# Altium project ECU V1.0 B.PrjPcb (part 2 of 17)
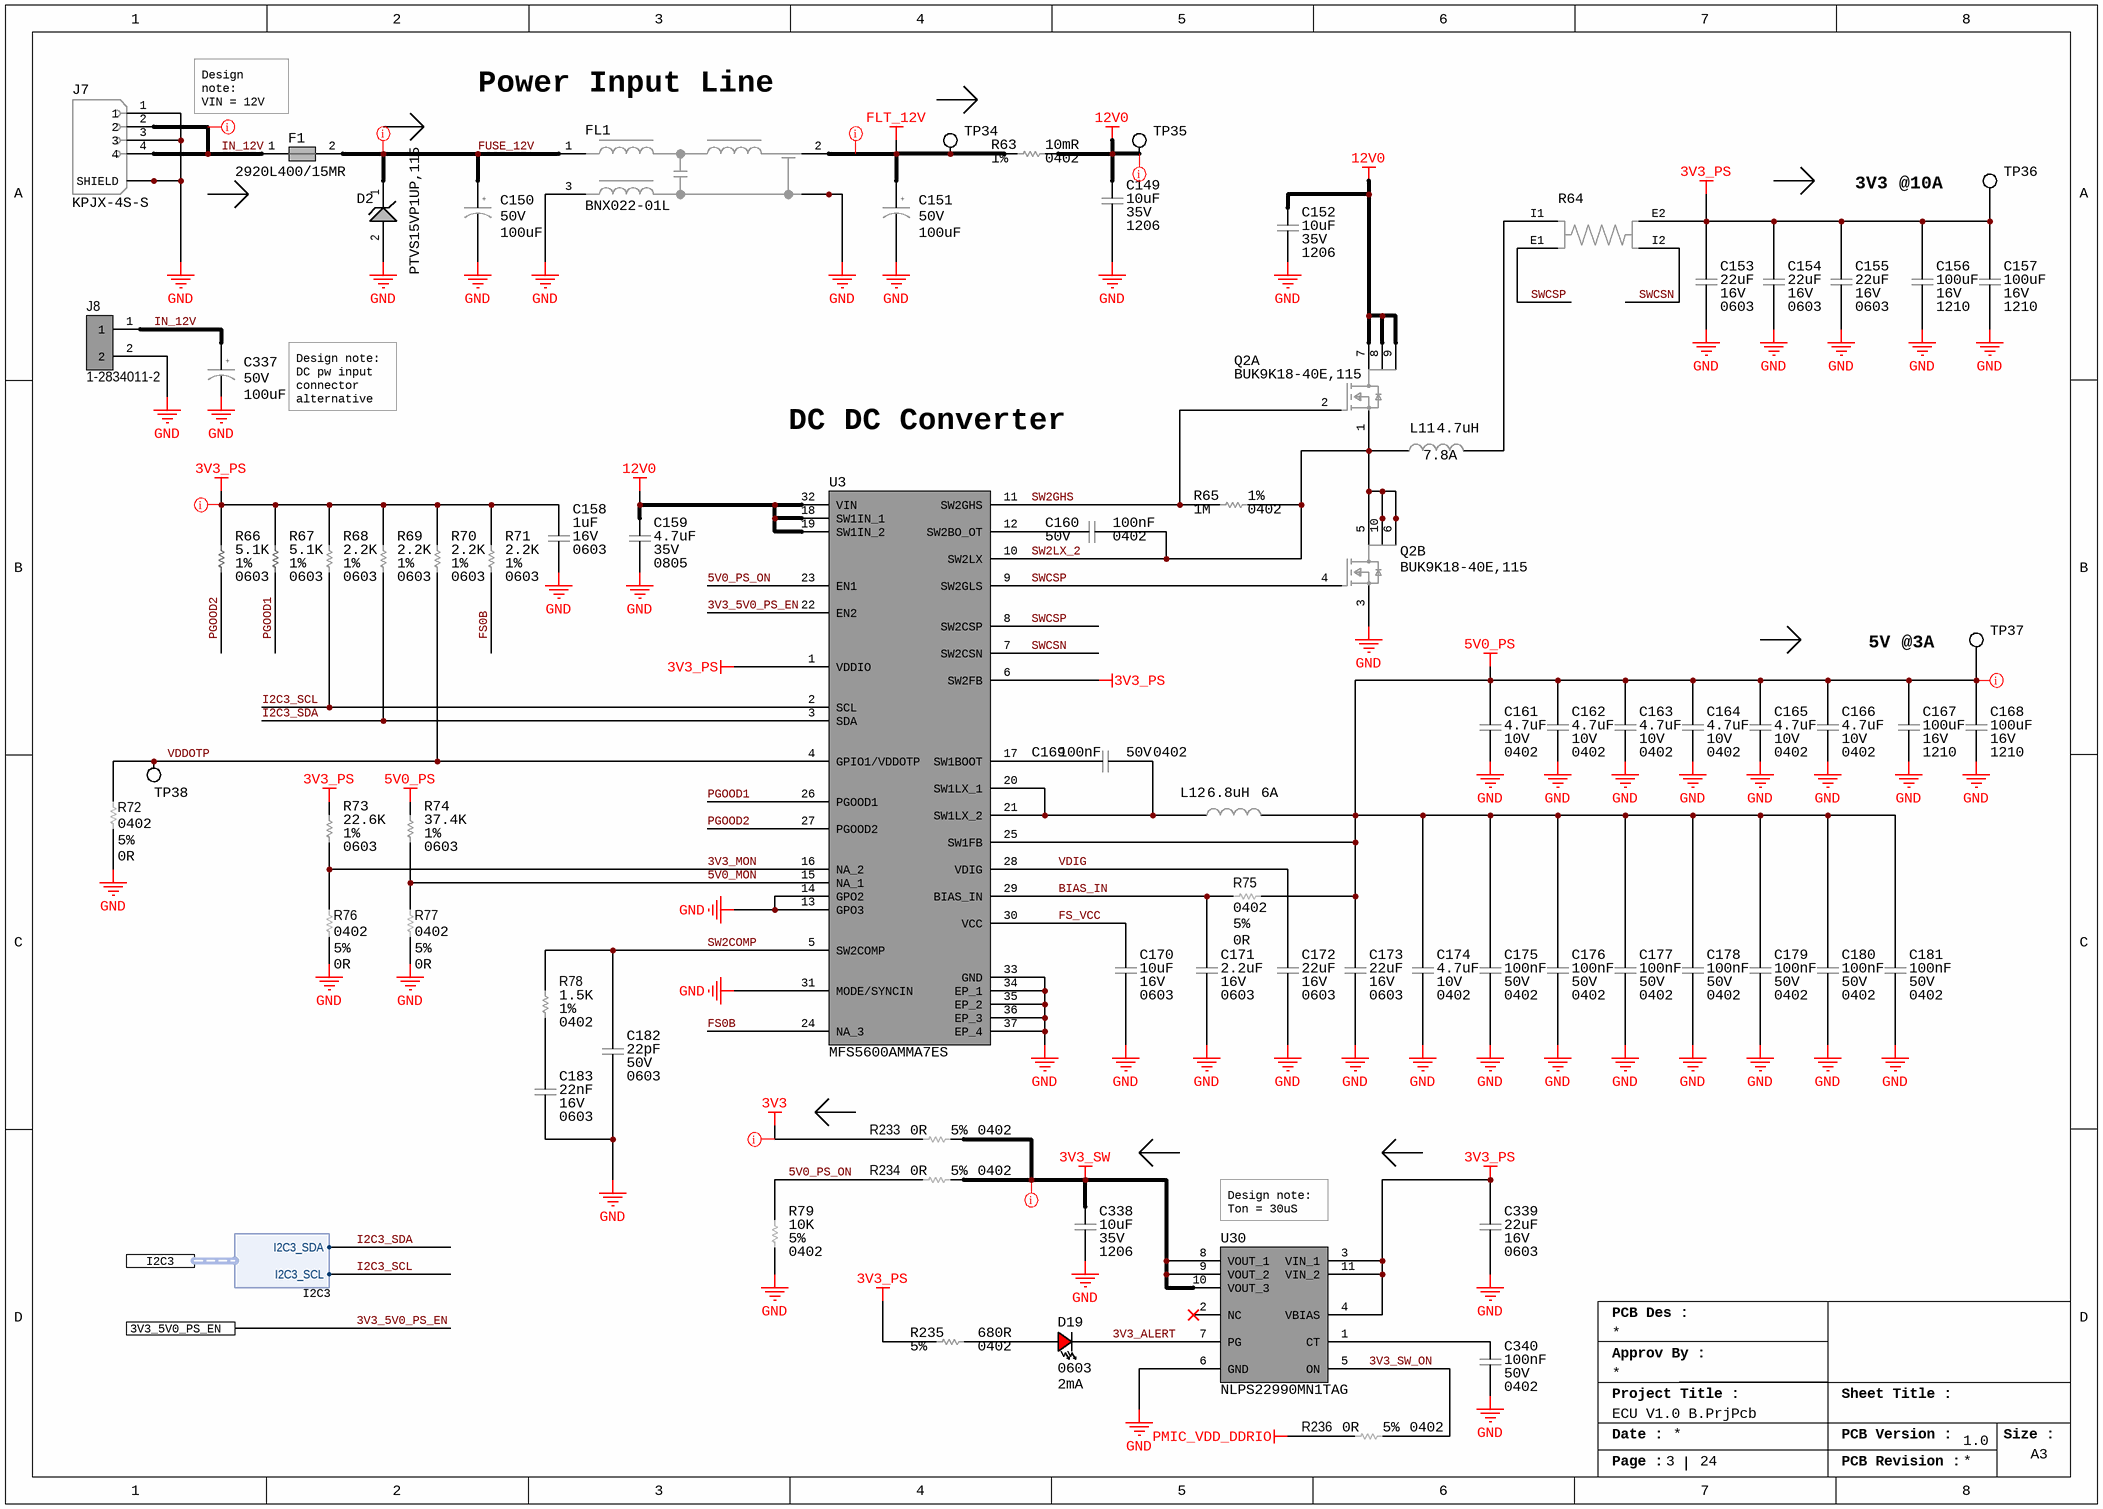
[diagram p18: 02_PWR IN.SchDoc]

## Sheet 02_PWR IN.SchDoc (continued)
### Library data of the parts
C149 C152 C338 = CAP_10uF_35V_X5R_1206: 1206 10 uF 35 V ±10 % Tolerance X5R SMT Multilayer Ceramic Capacitor; Manufacturer: Murata; Tolerance: 10%; Supplier 1: Mouser; Manufacturer Part Number: GRM319R6YA106KA12D; RoHS: Yes; Category: Ceramic Capacitors; Stock 1: 129741; Pricing 1: 1=0.3, 10=0.169, 50=0.169, 100=0.109, 1000=0.082, 10000=0.066 (USD); Mount: Surface Mount; Case Code (Metric): 3216; Case Code (Imperial): 1206; Weight: 0.001411oz; Min Operating Temperature: -55°C; Max Operating Temperature: 85°C; Packaging: Tape and Reel; Dielectric: X5R; Termination: Standard; Voltage Rating (DC): 35V; Package Quantity: 40000; Series: GRM; Length: 3.2mm; Width: 1.6mm; Height: 0.85mm; RoHS Compliant: Yes; ComponentLink1URL: http://www.farnell.com/datasheets/2079193.pdf?src-supplier=Farnell; ComponentLink1Description: http://www.farnell.com/datasheets/2079193.pdf?src-supplier=Farnell; ComponentLink2URL: http://www.mouser.com/ds/2/281/c02e-2905.pdf?src-supplier=Mouser; ComponentLink2Description: http://www.mouser.com/ds/2/281/c02e-2905.pdf?src-supplier=Mouser; ComponentLink3URL: http://search.murata.co.jp/Ceramy/image/img/A01X/G101/ENG/GRM319R6YA106KA12-01.pdf?src-supplier=Digi-Key; ComponentLink3Description: http://search.murata.co.jp/Ceramy/image/img/A01X/G101/ENG/GRM319R6YA106KA12-01.pdf?src-supplier=Digi-Key; ComponentLink4URL: http://www.farnell.com/datasheets/2079193.pdf?src-supplier=Element14; ComponentLink4Description: http://www.farnell.com/datasheets/2079193.pdf?src-supplier=Element14; ComponentLink5URL: https://datasheet.octopart.com/GRM319R6YA106KA12D-Murata-datasheet-136617269.pdf?src-supplier=TME; ComponentLink5Description: https://datasheet.octopart.com/GRM319R6YA106KA12D-Murata-datasheet-136617269.pdf?src-supplier=TME; Supplier Part Number 1: 81-GRM319R6YA106KA2D
C150 C151 C337 = CAP_100UF_50V_POL: Radial Can - SMD ALUMINUM ELECTROLYTIC CAPACITOR UUD 50V 100muF ±20% 0.315Dia 8.00mm; Manufacturer: Nichicon; Dielectric Material: Aluminium; Ripple Current (AC): 300mA; Impedance: 340mR; Leakage Current: 3uA; Life (Hours): 5000Hour; Dissipation Factor: 0.14%; Polarity: 5066Direction; Lead Diameter: 1.1mm; Supplier 1: Mouser; Manufacturer Part Number: UUD1H101MNL1GS; RoHS: Yes; Category: Aluminum Electrolytic Capacitors; Stock 1: 2204; Pricing 1: 1=0.53, 10=0.313, 50=0.313, 100=0.202, 500=0.202, 1000=0.171, 2500=0.151, 10000=0.138, 25000=0.136, 50000=0.131 (USD); Case/Package: Radial; Number of Pins: 2; Min Operating Temperature: -55°C; Max Operating Temperature: 105°C; Tolerance: 20%; Package Quantity: 500; Ripple Current: 300mA; Packaging: Tape and Reel; Voltage Rating: 50V; Termination: SMD/SMT; Voltage: 50V; Series: UD; Construction: Cylindrical; Voltage Rating (AC): 50V; Diameter: 8mm; Length: 10mm; Height: 10mm; Lead Pitch: 3.1mm; Height - Seated (Max): 0.394inch; Radiation Hardening: No; Reach SVHC Compliant: No; Lead Free: Lead Free; RoHS Compliant: Yes; ComponentLink1URL: https://datasheet.ciiva.com/11781/0900766b80fa39e7-11781901.pdf?src-supplier=Rs; ComponentLink1Description: https://datasheet.ciiva.com/11781/0900766b80fa39e7-11781901.pdf?src-supplier=Rs; ComponentLink2URL: https://datasheet.ciiva.com/28458/e-ud-28458117.pdf?src-supplier=Element14; ComponentLink2Description: https://datasheet.ciiva.com/28458/e-ud-28458117.pdf?src-supplier=Element14; ComponentLink3URL: https://datasheet.ciiva.com/28458/1910936-28458133.pdf?src-supplier=Element14; ComponentLink3Description: https://datasheet.ciiva.com/28458/1910936-28458133.pdf?src-supplier=Element14; ComponentLink4URL: https://datasheet.ciiva.com/7781/66055-7781450.pdf?src-supplier=Element14; ComponentLink4Description: https://datasheet.ciiva.com/7781/66055-7781450.pdf?src-supplier=Element14; ComponentLink5URL: https://datasheet.ciiva.com/5362/e-ud-5362134.pdf?src-supplier=Mouser; ComponentLink5Description: https://datasheet.ciiva.com/5362/e-ud-5362134.pdf?src-supplier=Mouser; Supplier Part Number 1: 647-UUD1H101MNL
C153-C155 C172 C173 C339 = CAP_22UF_16V_X5R_0603: Cap Ceramic 22uF 16V X5R 20% Pad SMD 0603 85C T/R; Manufacturer: Samsung; Supplier 1: Digi-Key; Manufacturer Part Number: CL10A226MO7JZNC; RoHS: Yes; Category: Ceramic Capacitors; Stock 1: 1760065; Pricing 1: 1=0.59, 10=0.419, 50=0.3164, 100=0.2756, 500=0.20418, 1000=0.17355 (USD); Mount: Surface Mount; Case Code (Imperial): 0603; Case Code (Metric): 1608; Min Operating Temperature: -55°C; Max Operating Temperature: 85°C; Packaging: Cut Tape; Tolerance: 20%; Series: CL; RoHS Compliant: Yes; ComponentLink1URL: http://www.samsungsem.com/kr/support/product-search/mlcc/CL10A226MO7JZNC.jsp?src-supplier=Digi-Key; ComponentLink1Description: http://www.samsungsem.com/kr/support/product-search/mlcc/CL10A226MO7JZNC.jsp?src-supplier=Digi-Key; ComponentLink2URL: https://datasheet.octopart.com/CL10A226MO7JZNC-Samsung-Electro-Mechanics-datasheet-149156497.pdf?src-supplier=Future+Electronics; ComponentLink2Description: https://datasheet.octopart.com/CL10A226MO7JZNC-Samsung-Electro-Mechanics-datasheet-149156497.pdf?src-supplier=Future+Electronics; Supplier Part Number 1: 1276-7076-1-ND
C156 C157 C167 C168 = CAP_100UF_16V_X5R_1210: Multilayer Ceramic Capacitor, 100 uF, 16 V, ± 20%, X5R, 1210 [3225 Metric]; Manufacturer: Taiyo Yuden; Material: 4241ConductorMaterial; Supplier 1: Digikey; Manufacturer Part Number: EMK325ABJ107MM-T; RoHS: Yes; Category: Ceramic Capacitors; Stock 1: 503358; Pricing 1: 1=1.73, 10=1.295, 50=1.1816, 100=0.9681 (USD); Mount: Surface Mount; Case Code (Metric): 3225; Case Code (Imperial): 1210; Min Operating Temperature: -55°C; Max Operating Temperature: 85°C; Tolerance: 20%; Packaging: Tape and Reel; Package Quantity: 500; Voltage Rating (DC): 16V; Dielectric: X5R; Termination: SMD/SMT; Series: M; Length: 3.2mm; Width: 2.5mm; Height: 2.5mm; Reach SVHC Compliant: No; RoHS Compliant: Yes; ComponentLink1URL: http://www.farnell.com/datasheets/1497285.pdf?src-supplier=Farnell; ComponentLink1Description: http://www.farnell.com/datasheets/1497285.pdf?src-supplier=Farnell; Supplier Part Number 1: 587-3152-1-ND
C158 = CAP_1UF_16V_X5R_0603: CAP CER 1UF 16V X5R 0603; Manufacturer: Samsung; Material: Ceramic; Tolerance: 10%; Manufacturer Part Number: CL10A105KO8NNNC; RoHS: Yes; Category: Ceramic Capacitors; Stock 1: 252255; Pricing 1: 1=0.10000, 10=0.03300, 50=0.01800, 100=0.01470, 500=0.01050, 1000=0.00825 (USD); Mount: Surface Mount; Case Code (Metric): 1608; Case Code (Imperial): 0603; Contact Plating: Tin; Min Operating Temperature: -55°C; Max Operating Temperature: 85°C; Package Quantity: 1; Packaging: Tape and Reel; Dielectric: X5R; Voltage Rating (DC): 16V; Series: CL; Voltage: 16V; Construction: Flat; Length: 1.6mm; Width: 0.031inch; Height: 0.8mm; Thickness: 0.035inch; Depth: 0.8mm; Radiation Hardening: No; Lead Free: Lead Free; RoHS Compliant: Yes; ComponentLink1URL: https://datasheet.ciiva.com/16199/cl10a105ko8nnnc-16199033.pdf?src-supplier=Future+Electronics; ComponentLink1Description: https://datasheet.ciiva.com/16199/cl10a105ko8nnnc-16199033.pdf?src-supplier=Future+Electronics; ComponentLink2URL: https://datasheet.ciiva.com/15195/getdatasheetpartid-359688-15195706.pdf?src-supplier=Verical; ComponentLink2Description: https://datasheet.ciiva.com/15195/getdatasheetpartid-359688-15195706.pdf?src-supplier=Verical; ComponentLink3URL: https://datasheet.ciiva.com/29198/458190-da-01-en-vs-kondensator-0603-29198480.pdf?src-supplier=Conrad; ComponentLink3Description: https://datasheet.ciiva.com/29198/458190-da-01-en-vs-kondensator-0603-29198480.pdf?src-supplier=Conrad; Supplier 1: Digi-Key; Supplier 2: Mouser; Supplier 3: Newark; Supplier Part Number 1: 1276-1034-1-ND; Supplier Part Number 2: 187-CL10A105KO8NNNC; Supplier Part Number 3: 82AC9279
C159 = CAP_4.7uF_35V_X5R_0805: CL Series 0805 35 V 4.7 uF ±10% Tolerance X5R Multilayer Ceramic Chip Capacitor; Manufacturer: Samsung; Supplier 1: Digikey; Manufacturer Part Number: CL21A475KLCLQNC; RoHS: Yes; Category: Ceramic Capacitors; Stock 1: 96096; Pricing 1: 1=0.16, 10=0.093, 100=0.0574, 1000=0.03903 (USD); Mount: Surface Mount; Case Code (Metric): 2012; Case Code (Imperial): 0805; Material: Ceramic; Min Operating Temperature: -55°C; Max Operating Temperature: 85°C; Packaging: Cut Tape; Tolerance: 10%; Series: CL; Height: 1.45mm; RoHS Compliant: Yes; ComponentLink1URL: http://www.samsungsem.com/kr/support/product-search/mlcc/CL21A475KLCLQNC.jsp?src-supplier=Digikey; ComponentLink1Description: http://www.samsungsem.com/kr/support/product-search/mlcc/CL21A475KLCLQNC.jsp?src-supplier=Digikey; ComponentLink2URL: https://datasheet.octopart.com/CL21A475KLCLQNC-Samsung-Electro-Mechanics-datasheet-136031818.pdf?src-supplier=Future+Electronics; ComponentLink2Description: https://datasheet.octopart.com/CL21A475KLCLQNC-Samsung-Electro-Mechanics-datasheet-136031818.pdf?src-supplier=Future+Electronics; Supplier Part Number 1: 1276-6722-1-ND
C160 C169 C175-C181 C340 = CAP_100NF_50V_X7R_0402: Multilayer Ceramic Capacitor, 0.1 uF, 16 V, ± 10%, X7R, 0402 [1005 Metric]; Manufacturer: Murata; Dissipation Factor: 0.025%; Temperature Coefficient: 30ppm/°C; Supplier 1: DigiKey; Manufacturer Part Number: GRM155R71H104KE14D; RoHS: Yes; Category: Ceramic Capacitors; Stock 1: 13730790; Pricing 1: 1=0.1, 10=0.023, 50=0.0132, 100=0.0102, 500=0.00768, 1000=0.00603, 2500=0.00548, 5000=0.00504 (USD); Mount: Surface Mount; Number of Pins: 2NUMBER; Case Code (Metric): 1005; Material: Ceramic; Case Code (Imperial): 0402; Weight: 0.000212oz; Dielectric Material: Ceramic; Min Operating Temperature: -55°C; Max Operating Temperature: 125°C; Packaging: Tape and Reel; Package Quantity: 10000; Series: GRM; Tolerance: 10%; Dielectric: X7R; Termination: SMD/SMT; Voltage: 50V; Voltage Rating (DC): 50V; Construction: Flat; Length: 1mm; Width: 0.5mm; Height: 0.5mm; Depth: 0.5mm; Thickness: 0.022inch; Reach SVHC Compliant: No; RoHS Compliant: Yes; Lead Free: 5697LeadFree; ComponentLink1URL: http://www.farnell.com/datasheets/2079156.pdf?src-supplier=Farnell; ComponentLink1Description: http://www.farnell.com/datasheets/2079156.pdf?src-supplier=Farnell; ComponentLink2URL: http://www.mouser.com/ds/2/281/c02e-2905.pdf?src-supplier=Mouser; ComponentLink2Description: http://www.mouser.com/ds/2/281/c02e-2905.pdf?src-supplier=Mouser; ComponentLink3URL: http://www.farnell.com/datasheets/2079156.pdf?src-supplier=Newark; ComponentLink3Description: http://www.farnell.com/datasheets/2079156.pdf?src-supplier=Newark; ComponentLink4URL: https://datasheet.octopart.com/GRM155R71H104KE14D-Murata-datasheet-22122223.pdf?src-supplier=Future+Electronics; ComponentLink4Description: https://datasheet.octopart.com/GRM155R71H104KE14D-Murata-datasheet-22122223.pdf?src-supplier=Future+Electronics; ComponentLink5URL: https://search.murata.co.jp/Ceramy/image/img/A01X/G101/ENG/GRM155R71H104KE14-01.pdf?src-supplier=Digi-Key; ComponentLink5Description: https://search.murata.co.jp/Ceramy/image/img/A01X/G101/ENG/GRM155R71H104KE14-01.pdf?src-supplier=Digi-Key; ComponentLink6URL: http://psearch.en.murata.com/capacitor/product/GRM155R71H104KE14%23.pdf?src-supplier=Avnet; ComponentLink6Description: http://psearch.en.murata.com/capacitor/product/GRM155R71H104KE14%23.pdf?src-supplier=Avnet; ComponentLink7URL: https://datasheet.octopart.com/GRM155R71H104KE14D-Murata-datasheet-66077078.pdf?src-supplier=Element14; ComponentLink7Description: https://datasheet.octopart.com/GRM155R71H104KE14D-Murata-datasheet-66077078.pdf?src-supplier=Element14; Supplier Part Number 1: 490-10700-6-ND; Supplier 2: Digikey; Stock 2: 3706055; Pricing 2: 1=0.1, 10=0.037, 50=0.021, 100=0.0162, 500=0.01224, 1000=0.00961, 2500=0.00874, 5000=0.00804 (USD); Halogen Free: 5694HalogenFree; ComponentLink8URL: http://www.mouser.com/ds/2/447/UPY-GPHC_X5R_4V-to-50V_25-1131599.pdf?src-supplier=Mouser; ComponentLink8Description: http://www.mouser.com/ds/2/447/UPY-GPHC_X5R_4V-to-50V_25-1131599.pdf?src-supplier=Mouser; ComponentLink9URL: https://datasheet.octopart.com/CC0402KRX5R8BB104-Yageo-datasheet-137700082.pdf?src-supplier=Future+Electronics; ComponentLink9Description: https://datasheet.octopart.com/CC0402KRX5R8BB104-Yageo-datasheet-137700082.pdf?src-supplier=Future+Electronics; ComponentLink10URL: http://www.yageo.com/documents/recent/UPY-GPHC_X5R_4V-to-50V_25.pdf?src-supplier=Digikey; ComponentLink10Description: http://www.yageo.com/documents/recent/UPY-GPHC_X5R_4V-to-50V_25.pdf?src-supplier=Digikey; ComponentLink11URL: https://datasheet.octopart.com/CC0402KRX5R8BB104-Yageo-datasheet-140260304.pdf?src-supplier=Newark; ComponentLink11Description: https://datasheet.octopart.com/CC0402KRX5R8BB104-Yageo-datasheet-140260304.pdf?src-supplier=Newark; ComponentLink12URL: https://datasheet.octopart.com/CC0402KRX5R8BB104-Yageo-datasheet-170350636.pdf?src-supplier=Future+Electronics; ComponentLink12Description: https://datasheet.octopart.com/CC0402KRX5R8BB104-Yageo-datasheet-170350636.pdf?src-supplier=Future+Electronics; ComponentLink13URL: http://www.yageo.com/documents/recent/UPY-GPHC_X5R_4V-to-50V-16.pdf?src-supplier=Future+Electronics; ComponentLink13Description: http://www.yageo.com/documents/recent/UPY-GPHC_X5R_4V-to-50V-16.pdf?src-supplier=Future+Electronics; Supplier Part Number 2: 311-1697-1-ND
C161-C166 C174 = CAP_4.7UF_10V_X5R_0402: Multilayer Ceramic Capacitor, 4.7 uF, 10 V, ± 10%, X5R, 0402 [1005 Metric]; Manufacturer: Samsung; Supplier 1: Digikey; Manufacturer Part Number: CL05A475KP5NRNC; RoHS: Yes; Category: Ceramic Capacitors; Stock 1: 748042; Pricing 1: 1=0.28, 10=0.184, 50=0.129, 100=0.1042, 500=0.0774, 1000=0.06772, 2500=0.0645, 5000=0.05966 (USD); Mount: Surface Mount; Case Code (Metric): 1005; Case Code (Imperial): 0402; Material: Ceramic; Min Operating Temperature: -55°C; Max Operating Temperature: 85°C; Tolerance: 10%; Packaging: Tape and Reel; Package Quantity: 1; Dielectric: X5R; Series: CL; Construction: Flat; Length: 1mm; Width: 0.02inch; Height: 0.5mm; Thickness: 0.022inch; Depth: 0.5mm; Radiation Hardening: No; RoHS Compliant: Yes; Lead Free: Lead Free; ComponentLink1URL: https://datasheet.ciiva.com/25724/cl05a475kp5nrnc-25724404.pdf?src-supplier=Digikey; ComponentLink1Description: https://datasheet.ciiva.com/25724/cl05a475kp5nrnc-25724404.pdf?src-supplier=Digikey; ComponentLink2URL: https://datasheet.ciiva.com/29198/458873-da-01-en-vs-kondensator-0402-29198304.pdf?src-supplier=Conrad; ComponentLink2Description: https://datasheet.ciiva.com/29198/458873-da-01-en-vs-kondensator-0402-29198304.pdf?src-supplier=Conrad; Supplier Part Number 1: 1276-1480-1-ND
C170 = CAP_10UF_16V_X5R_0603: 0603 10 uF 16 V ±20% Tolerance X5R Multilayer Ceramic Chip Capacitor; Manufacturer: Murata; Manufacturer Part Number: GRM188R61C106MAALD; RoHS: Yes; Category: Ceramic Capacitors; Stock 1: 566627; Pricing 1: 1=0.24000, 10=0.16500, 50=0.11000, 100=0.09340, 500=0.06596, 1000=0.05771 (USD); Mount: Surface Mount; Case Code (Metric): 1608; Material: Ceramic; Case Code (Imperial): 0603; Min Operating Temperature: -55°C; Max Operating Temperature: 85°C; Tolerance: 20%; Packaging: Cut Tape; Voltage Rating (DC): 16V; Length: 0.063inch; Width: 0.031inch; Height: 0.8mm; Thickness: 0.037inch; Lead Free: Lead Free; RoHS Compliant: Yes; ComponentLink1URL: http://search.murata.co.jp/Ceramy/image/img/A01X/G101/ENG/GRM188R61C106MAAL-01.pdf?src-supplier=Digi-Key; ComponentLink1Description: http://search.murata.co.jp/Ceramy/image/img/A01X/G101/ENG/GRM188R61C106MAAL-01.pdf?src-supplier=Digi-Key; ComponentLink2URL: https://search.murata.co.jp/Ceramy/image/img/A01X/G101/ENG/GRM188R61C106MAAL-01.pdf?src-supplier=Digi-Key; ComponentLink2Description: https://search.murata.co.jp/Ceramy/image/img/A01X/G101/ENG/GRM188R61C106MAAL-01.pdf?src-supplier=Digi-Key; ComponentLink3URL: http://search.murata.co.jp/Ceramy/image/img/A01X/partnumbering_e_01.pdf?src-supplier=Digi-Key; ComponentLink3Description: http://search.murata.co.jp/Ceramy/image/img/A01X/partnumbering_e_01.pdf?src-supplier=Digi-Key; Supplier 1: Digi-Key; Supplier 2: Verical; Supplier 3: Mouser; Supplier Part Number 1: 490-10729-1-ND; Supplier Part Number 2: GRM188R61C106MAALD; Supplier Part Number 3: 81-GRM188R61C106MALD
C171 = CAP_2.2UF_16V_X7R_0603: Multilayer Ceramic Capacitors (High dielectric type), 16V, 2.2 uF, ± 10 %, 0603, X7R, RoHS; Manufacturer: Taiyo Yuden; Material: 4241ConductorMaterial; Tolerance: 10%; Supplier 1: Digikey; Manufacturer Part Number: EMK107BB7225KA-T; RoHS: Yes; Category: Ceramic Capacitors; Stock 1: 390946; Pricing 1: 1=0.27, 10=0.177, 50=0.124, 100=0.1002, 500=0.07442, 1000=0.06511 (USD); Mount: Surface Mount; Case Code (Imperial): 0603; Case Code (Metric): 1608; Min Operating Temperature: -55°C; Max Operating Temperature: 125°C; Packaging: Cut Tape; Voltage Rating (DC): 16V; Series: M; Length: 0.063inch; Width: 0.031inch; Height: 1mm; Thickness: 0.035inch; Halogen Free: Halogen Free; RoHS Compliant: Yes; ComponentLink1URL: http://www.yuden.co.jp/productdata/catalog/en/mlcc06_e.pdf?src-supplier=Digikey; ComponentLink1Description: http://www.yuden.co.jp/productdata/catalog/en/mlcc06_e.pdf?src-supplier=Digikey; ComponentLink2URL: http://ds.yuden.co.jp/TYCOMPAS/ut/detail.do?productNo=EMK107BB7225KA-T&fileName=EMK107BB7225KA-T_SS&mode=specSheetDownload&src-supplier=Digikey; ComponentLink2Description: http://ds.yuden.co.jp/TYCOMPAS/ut/detail.do?productNo=EMK107BB7225KA-T&fileName=EMK107BB7225KA-T_SS&mode=specSheetDownload&src-supplier=Digikey; ComponentLink3URL: https://ds.yuden.co.jp/TYCOMPAS/ut/detail?pn=EMK107BB7225KA-T  &amp;u=M&src-supplier=Digikey; ComponentLink3Description: https://ds.yuden.co.jp/TYCOMPAS/ut/detail?pn=EMK107BB7225KA-T  &amp;u=M&src-supplier=Digikey; ComponentLink4URL: http://ds3.yuden.co.jp/TYCOMPAS/ut/detail.do?productNo=EMK107BB7225KA-T&dataUnit=M&src-supplier=Avnet; ComponentLink4Description: http://ds3.yuden.co.jp/TYCOMPAS/ut/detail.do?productNo=EMK107BB7225KA-T&dataUnit=M&src-supplier=Avnet; ComponentLink5URL: https://datasheet.octopart.com/EMK107BB7225KA-T-Taiyo-Yuden-datasheet-99833418.pdf?src-supplier=Future+Electronics; ComponentLink5Description: https://datasheet.octopart.com/EMK107BB7225KA-T-Taiyo-Yuden-datasheet-99833418.pdf?src-supplier=Future+Electronics; ComponentLink6URL: https://datasheet.octopart.com/EMK107BB7225KA-T-Taiyo-Yuden-datasheet-154808275.pdf?src-supplier=Master+Electronics; ComponentLink6Description: https://datasheet.octopart.com/EMK107BB7225KA-T-Taiyo-Yuden-datasheet-154808275.pdf?src-supplier=Master+Electronics; Supplier Part Number 1: 587-5835-1-ND
C182 = CAP_22pF_50V_NP0_0603: Multilayer Ceramic Capacitor, 22 pF, 50 V, ï¿½ 5%, C0G (NP0), 0603 [1608 Metric]; Manufacturer: KEMET; Material: 4241ConductorMaterial; Supplier 1: Digikey; Manufacturer Part Number: C0603C220J5GACTU; RoHS: Yes; Category: Ceramic Capacitors; Stock 1: 183000; Pricing 1: 4000=0.02237, 8000=0.02081, 12000=0.01977, 28000=0.01873, 100000=0.01418, 200000=0.01384, 400000=0.013 (USD); Mount: Surface Mount,PCB; Case Code (Metric): 1608; Case Code (Imperial): 0603; Weight: 7.1E-05oz; Min Operating Temperature: -55°C; Max Operating Temperature: 125°C; Tolerance: 5%; Dielectric: C0G; Packaging: Tape and Reel; Termination: SMD/SMT; Voltage: 50V; Series: SMD Comm C0G; Construction: Flat; Voltage Rating: 50V; Length: 1.6mm; Width: 0.8mm; Height: 0.8mm; Depth: 0.8mm; Radiation Hardening: No; Lead Free: Lead Free; RoHS Compliant: Yes; ComponentLink1URL: https://datasheet.ciiva.com/7824/f9080b-0402-series-c0g-7824012.pdf?src-supplier=Element14; ComponentLink1Description: https://datasheet.ciiva.com/7824/f9080b-0402-series-c0g-7824012.pdf?src-supplier=Element14; ComponentLink2URL: https://datasheet.ciiva.com/14586/70095383-14586058.pdf?src-supplier=Allied+Electronics; ComponentLink2Description: https://datasheet.ciiva.com/14586/70095383-14586058.pdf?src-supplier=Allied+Electronics; ComponentLink3URL: https://datasheet.ciiva.com/14599/70095383-14599853.pdf?src-supplier=Allied+Electronics; ComponentLink3Description: https://datasheet.ciiva.com/14599/70095383-14599853.pdf?src-supplier=Allied+Electronics; Supplier Part Number 1: 399-C0603C220J5GAC7867TR-ND
C183 = CAP_22nF_16V_X7R_0603: Multilayer Ceramic Capacitor, 0.022 uF, 16 V, ± 10%, X7R, 0603 [1608 Metric]; Manufacturer: KEMET; Supplier 1: Digikey; Manufacturer Part Number: C0603C223K4RACTU; RoHS: Yes; Category: Ceramic Capacitors; Stock 1: 159667; Pricing 1: 1=0.1, 10=0.053, 50=0.0304, 100=0.0235, 500=0.01768, 1000=0.01389 (USD); Mount: Surface Mount; Case Code (Imperial): 0603; Case Code (Metric): 1608; Weight: 7.1E-05oz; Min Operating Temperature: -55°C; Max Operating Temperature: 125°C; Tolerance: 10%; Dielectric: X7R; Packaging: Tape and Reel; Package Quantity: 1; Termination: SMD/SMT; Series: C; Voltage Rating: 16V; Construction: Flat; Length: 1.6mm; Width: 0.031inch; Height: 0.8mm; Thickness: 0.034inch; Depth: 0.8mm; Radiation Hardening: No; RoHS Compliant: Yes; Reach SVHC Compliant: No; ComponentLink1URL: https://datasheet.ciiva.com/49516/1636924-49516646.pdf?src-supplier=Jameco; ComponentLink1Description: https://datasheet.ciiva.com/49516/1636924-49516646.pdf?src-supplier=Jameco; ComponentLink2URL: https://datasheet.ciiva.com/26847/getdatasheetpartid-724406-26847612.pdf?src-supplier=Verical; ComponentLink2Description: https://datasheet.ciiva.com/26847/getdatasheetpartid-724406-26847612.pdf?src-supplier=Verical; ComponentLink3URL: https://datasheet.ciiva.com/14599/70095383-14599397.pdf?src-supplier=Allied+Electronics; ComponentLink3Description: https://datasheet.ciiva.com/14599/70095383-14599397.pdf?src-supplier=Allied+Electronics; ComponentLink4URL: https://datasheet.ciiva.com/14601/70095383-14601245.pdf?src-supplier=Allied+Electronics; ComponentLink4Description: https://datasheet.ciiva.com/14601/70095383-14601245.pdf?src-supplier=Allied+Electronics; Supplier Part Number 1: 399-C0603C223K4RAC7867CT-ND
D2 = DIO_TVS_24.4V_PTVS15VP1UP,115: TVS DIODE 15VWM 24.4VC SOD128; Manufacturer: Nexperia; Supplier 1: Digikey; Manufacturer Part Number: PTVS15VP1UP,115; RoHS: Yes; Category: TVS Diodes; Stock 1: 29483; Pricing 1: 1=0.43, 10=0.258, 100=0.199, 500=0.173, 1000=0.141, 3000=0.11, 6000=0.10975 (USD); RoHS Compliant: Yes; ComponentLink1URL: https://assets.nexperia.com/documents/data-sheet/PTVSXP1UP_SER.pdf?src-supplier=Digikey; ComponentLink1Description: https://assets.nexperia.com/documents/data-sheet/PTVSXP1UP_SER.pdf?src-supplier=Digikey; ComponentLink2URL: https://datasheet.octopart.com/PTVS15VP1UP%2C115-Nexperia-datasheet-85391138.pdf?src-supplier=Future+Electronics; ComponentLink2Description: https://datasheet.octopart.com/PTVS15VP1UP%2C115-Nexperia-datasheet-85391138.pdf?src-supplier=Future+Electronics; ComponentLink3URL: https://datasheet.octopart.com/PTVS15VP1UP%2C115-Nexperia-datasheet-10026048.pdf?src-supplier=Newark; ComponentLink3Description: https://datasheet.octopart.com/PTVS15VP1UP%2C115-Nexperia-datasheet-10026048.pdf?src-supplier=Newark; ComponentLink4URL: https://datasheet.octopart.com/PTVS15VP1UP%2C115-Nexperia-datasheet-103140512.pdf?src-supplier=TME; ComponentLink4Description: https://datasheet.octopart.com/PTVS15VP1UP%2C115-Nexperia-datasheet-103140512.pdf?src-supplier=TME; Supplier Part Number 1: 1727-4428-1-ND
D19 = LED_DIO_RED_2mA_0603_LTST-C193KRKT-2A: Led Red Clear 0603 Smd; Manufacturer: Vishay Lite-On; Lens Color: Colorless; Viewing Angle: 130°; Forward Voltage: 1.9V; Lens Style: Flat; Luminous Intensity: 6.5mcd; Dominant Wavelength: 629nm; Lens Size: 0.8mm; Supplier 1: Digikey; Manufacturer Part Number: LTST-C193KRKT-2A; RoHS: Yes; Category: LEDs; Stock 1: 77790; Pricing 1: 1=0.29, 10=0.16, 100=0.0978, 500=0.07338, 1000=0.06593, 2000=0.05983, 5000=0.05343, 10000=0.04959, 15000=0.04768, 25000=0.04556, 35000=0.04433, 50000=0.04314, 125000=0.0406, 250000=0.03907 (USD); Mount: Surface Mount; Color: Red; Case Code (Metric): 1608; Case Code (Imperial): 0603; Packaging: Cut Tape; Series: -; Lens Transparency: Clear; Length: 1.6mm; Width: 0.8mm; Height: 0.35mm; RoHS Compliant: Yes; ComponentLink1URL: https://datasheet.ciiva.com/6348/ltst-c193krkt-2a-6348473.pdf?src-supplier=Digikey; ComponentLink1Description: https://datasheet.ciiva.com/6348/ltst-c193krkt-2a-6348473.pdf?src-supplier=Digikey; ComponentLink2URL: https://datasheet.ciiva.com/6348/ltst-c193krkt-2a-6348475.pdf?src-supplier=Digikey; ComponentLink2Description: https://datasheet.ciiva.com/6348/ltst-c193krkt-2a-6348475.pdf?src-supplier=Digikey; ComponentLink3URL: https://datasheet.ciiva.com/6348/ltst-c193krkt-2a-6348477.pdf?src-supplier=Digikey; ComponentLink3Description: https://datasheet.ciiva.com/6348/ltst-c193krkt-2a-6348477.pdf?src-supplier=Digikey; Supplier Part Number 1: 160-1909-1-ND
F1 = FUSE_PTC_8A_2920L400/15MR: PTC Resettable Fuse 4A(hold) 8A(trip) 15VDC 40A 1.5W 4s 0.01Ohm SMD Solder Pad 2920 T/R; Manufacturer: Littelfuse; Voltage Rating: 15V; Supplier 1: Digikey; Manufacturer Part Number: 2920L400/15MR; RoHS: Yes; Category: PTC Resettable Fuses; Stock 1: 26599; Pricing 1: 1=1.76, 5=1.462, 10=1.349, 50=1.1192, 100=1.0326, 250=0.92788, 500=0.85544 (USD); Mount: Surface Mount; Case/Package: 448Case; Case Code (Imperial): 2920; Case Code (Metric): 7351; Min Operating Temperature: -40°C; Max Operating Temperature: 85°C; Packaging: Cut Tape; Max Current Rating: 40A; Hold Current: 4A; Trip Current: 8A; Time to Trip: 4s; Series: POLY-FUSE®, 2920L; Current Rating: 40A; Power Dissipation: 1.5W; Height: 1.6mm; ComponentLink1URL: http://www.farnell.com/datasheets/2282560.pdf?src-supplier=Farnell; ComponentLink1Description: http://www.farnell.com/datasheets/2282560.pdf?src-supplier=Farnell; ComponentLink2URL: https://www.littelfuse.com/~/media/electronics/datasheets/resettable_ptcs/littelfuse_ptc_2920l_datasheet.pdf.pdf?src-supplier=Digikey; ComponentLink2Description: https://www.littelfuse.com/~/media/electronics/datasheets/resettable_ptcs/littelfuse_ptc_2920l_datasheet.pdf.pdf?src-supplier=Digikey; ComponentLink3URL: http://www.littelfuse.com/~/media/electronics/datasheets/resettable_ptcs/littelfuse_ptc_2920l_datasheet.pdf.pdf?src-supplier=Digikey; ComponentLink3Description: http://www.littelfuse.com/~/media/electronics/datasheets/resettable_ptcs/littelfuse_ptc_2920l_datasheet.pdf.pdf?src-supplier=Digikey; ComponentLink4URL: https://datasheet.octopart.com/2920L400-15MR-Littelfuse-datasheet-170903999.pdf?src-supplier=Future+Electronics; ComponentLink4Description: https://datasheet.octopart.com/2920L400-15MR-Littelfuse-datasheet-170903999.pdf?src-supplier=Future+Electronics; ComponentLink5URL: https://datasheet.octopart.com/2920L400-15MR-Littelfuse-datasheet-98220083.pdf?src-supplier=Newark; ComponentLink5Description: https://datasheet.octopart.com/2920L400-15MR-Littelfuse-datasheet-98220083.pdf?src-supplier=Newark; ComponentLink6URL: https://datasheet.octopart.com/2920L400-15MR-Littelfuse-datasheet-27584453.pdf?src-supplier=Future+Electronics; ComponentLink6Description: https://datasheet.octopart.com/2920L400-15MR-Littelfuse-datasheet-27584453.pdf?src-supplier=Future+Electronics; ComponentLink7URL: https://datasheet.octopart.com/2920L400-15MR-Littelfuse-datasheet-184785072.pdf?src-supplier=Sager+Electronics; ComponentLink7Description: https://datasheet.octopart.com/2920L400-15MR-Littelfuse-datasheet-184785072.pdf?src-supplier=Sager+Electronics; Supplier Part Number 1: F8136DKR-ND
FL1 = FILTER_EMI_50VDC_10A_BNX022-01L: EMI Filter 1MHz to 1000MHz 35dB 10A 50VDC Flat Style SMD Embossed T/R; Manufacturer: Murata; Voltage Rating: 50V; Number of Channels: 2; ESD Protection: No; Insulation Resistance: 500MR; Operating Frequency: 1 to 1000 MHz; Supplier 1: Digikey; Manufacturer Part Number: BNX022-01L; RoHS: Yes; Category: EMI / RFI Components; Stock 1: 242; Pricing 1: 1=4.65, 10=3.788, 25=3.4936, 50=3.2864, 100=3.0915, 400=2.7902, 800=2.62451, 1200=2.53212, 2000=2.42025, 2800=2.36813 (USD); Mount: Surface Mount; Case/Package: SMD/SMT; Min Operating Temperature: -40°C; Max Operating Temperature: 125°C; Max Current Rating: 10A; Current Rating: 10A; Max Voltage Rating (DC): 50V; Package Quantity: 1; Packaging: Tape and Reel; Attenuation Value: 35dB; Current: 10A; Circuit Type: Filter; Termination: Flat; Max DC Current: 10A; Series: EMIFIL®, BNX02; Length: 12.1mm; Width: 0.358inch; Height: 3.1mm; Depth: 9.1mm; Reach SVHC Compliant: No; Lead Free: Lead Free; RoHS Compliant: Yes; ComponentLink1URL: https://datasheet.ciiva.com/11796/0900766b80f15483-11796696.pdf?src-supplier=Rs; ComponentLink1Description: https://datasheet.ciiva.com/11796/0900766b80f15483-11796696.pdf?src-supplier=Rs; ComponentLink2URL: https://datasheet.ciiva.com/6211/bnx02x-series-6211239.pdf?src-supplier=Digikey; ComponentLink2Description: https://datasheet.ciiva.com/6211/bnx02x-series-6211239.pdf?src-supplier=Digikey; ComponentLink3URL: https://datasheet.ciiva.com/6211/bnx02x-series-6211243.pdf?src-supplier=Digikey; ComponentLink3Description: https://datasheet.ciiva.com/6211/bnx02x-series-6211243.pdf?src-supplier=Digikey; ComponentLink4URL: https://datasheet.ciiva.com/6211/bnx02x-series-6211245.pdf?src-supplier=Digikey; ComponentLink4Description: https://datasheet.ciiva.com/6211/bnx02x-series-6211245.pdf?src-supplier=Digikey; ComponentLink5URL: https://datasheet.ciiva.com/1468/1851728-1468253.pdf?src-supplier=Element14; ComponentLink5Description: https://datasheet.ciiva.com/1468/1851728-1468253.pdf?src-supplier=Element14; ComponentLink6URL: https://datasheet.ciiva.com/1468/1851728-1468254.pdf?src-supplier=Element14; ComponentLink6Description: https://datasheet.ciiva.com/1468/1851728-1468254.pdf?src-supplier=Element14; Supplier Part Number 1: 490-5052-1-ND
J7 = CONN_DC_JACK_PWR_KPJX-4S-S: Conn Power SKT 4 POS Solder ST Thru-Hole 4 Terminal 1 Port; Manufacturer: Kycon; Voltage Rating: 20V; Voltage Rating (DC): 48V; Gender: Female; Current Rating: 7.5A; Insulation Resistance: 50MR; Number of Contacts: 4; Shielding: Shielded; Supplier 1: Digikey; Manufacturer Part Number: KPJX-4S-S; RoHS: Yes; Category: Circular Connectors; Stock 1: 12398; Pricing 1: 1=1.64, 10=1.397, 25=1.3092, 50=1.2468, 170=1.14347, 340=1.08885, 510=1.05814, 1020=1.00762, 2550=0.94456 (USD); Mount: Through Hole; Color: Black,Silver; Contact Material: Brass; Contact Plating: Tin; Housing Material: PBT; Shell Material: PBT; Contact Finish - Mating: TIN; Min Operating Temperature: -40°C; Max Operating Temperature: 75°C; Packaging: Tray; Package Quantity: 170; Termination: Solder; Series: KPJX; Contact Gender: Female; Connector Type: Power; Orientation: Straight; Fastening Type: SNAP-IN; Radiation Hardening: No; RoHS Compliant: Yes; Flammability Rating: UL94 V-0; ComponentLink1URL: https://datasheet.ciiva.com/4561/kpjx-365262-4561421.pdf?src-supplier=Mouser; ComponentLink1Description: https://datasheet.ciiva.com/4561/kpjx-365262-4561421.pdf?src-supplier=Mouser; Supplier Part Number 1: 2092-KPJX-4S-S-ND
J8 = CONN_TBLOCK_2P_3.5mm_1-2834011-2: 2POS3.5MMTOPENTRYSCREWLESSC; Manufacturer: TE Connectivity; Current Rating: 6A; Voltage Rating: 300V; Connector Type: Receptacle,Connector; Number of Positions: 2; Sealable: No (Without); Number of Levels: 1; Wire/Cable Gauge: 14AWG; Wire Gauge (Max): 20AWG; Approvals: UL; Supplier 1: Digikey; Manufacturer Part Number: 1-2834011-2; RoHS: Yes; Category: Terminal Blocks; Stock 1: 110419; Pricing 1: 1=0.25, 10=0.209, 25=0.194, 50=0.1832, 100=0.1732, 250=0.16068, 500=0.15182, 1000=0.14552 (USD); Mount: Through Hole; Number of Pins: 2; Contact Plating: Tin,Lead; Color: Green; Housing Material: Nylon; Min Operating Temperature: -40°C; Max Operating Temperature: 105°C; Packaging: Box; Termination: Through Hole; Contact Current Rating: 6A; Series: -; Number of Positions Per Level: 2; Current: 6A; Voltage: 300V; Wire Gauge (Min): 14AWG; Lead Free: Lead Free; RoHS Compliant: Yes; Reach SVHC Compliant: Unknown; ComponentLink1URL: http://www.te.com/commerce/DocumentDelivery/DDEController?Action=srchrtrv&DocNm=1-1773872-7_ModularScrewlessTerminalBloc&DocType=DS&DocLang=English&src-supplier=Digikey; ComponentLink1Description: http://www.te.com/commerce/DocumentDelivery/DDEController?Action=srchrtrv&DocNm=1-1773872-7_ModularScrewlessTerminalBloc&DocType=DS&DocLang=English&src-supplier=Digikey; ComponentLink2URL: https://datasheet.octopart.com/1-2834011-2-TE-Connectivity-datasheet-62069794.pdf?src-supplier=Farnell; ComponentLink2Description: https://datasheet.octopart.com/1-2834011-2-TE-Connectivity-datasheet-62069794.pdf?src-supplier=Farnell; ComponentLink3URL: http://www.farnell.com/datasheets/2296738.pdf?src-supplier=Newark; ComponentLink3Description: http://www.farnell.com/datasheets/2296738.pdf?src-supplier=Newark; ComponentLink4URL: https://datasheet.octopart.com/1-2834011-2-TE-Connectivity-datasheet-77874288.pdf?src-supplier=Element14; ComponentLink4Description: https://datasheet.octopart.com/1-2834011-2-TE-Connectivity-datasheet-77874288.pdf?src-supplier=Element14; Supplier Part Number 1: A123848-ND
L11 = IND_4.7uH_7.8A_SPM7054VT-4R7M-D: Inductor Power Shielded Wirewound 4.7uH 20% 100KHz Metal 7.8A 0.01826Ohm DCR Automotive T/R; Manufacturer: TDK; Saturation current: 11.2A; Supplier 1: Digikey; Manufacturer Part Number: SPM7054VT-4R7M-D; RoHS: Yes; Category: Fixed Inductors; Stock 1: 508; Pricing 1: 1=1.25, 10=1.025, 25=0.9484, 50=0.894, 100=0.843, 250=0.77988, 500=0.73538 (USD); RoHS Compliant: Yes; ComponentLink1URL: https://product.tdk.com/info/en/catalog/datasheets/inductor_automotive_power_spm7054vt-d_en.pdf?ref_disty=digikey&src-supplier=Digikey; ComponentLink1Description: https://product.tdk.com/info/en/catalog/datasheets/inductor_automotive_power_spm7054vt-d_en.pdf?ref_disty=digikey&src-supplier=Digikey; Supplier Part Number 1: 445-SPM7054VT-4R7M-DCT-ND
L12 = IND_6.8uH_6A_74437368068: WE-LHMI; 6800 nH; Composite Iron Multilayer SMD Inductor; 1040 Case; .013GHz 6A; Manufacturer: Wurth Electronics; Core Material: Ferrite,Composite; Inductance Tolerance: 20%; Self Resonant Frequency: 13MHz; Shielding: Shielded; Saturation Current: 14A; DC Resistance (DCR): 23.3mR; Test Frequency: 100kHz; Supplier 1: Digikey; Manufacturer Part Number: 74437368068; RoHS: Yes; Category: Fixed Inductors; Stock 1: 1656; Pricing 1: 1=2.31, 10=2.264, 50=2.089, 100=1.9152, 250=1.82792 (USD); Mount: Surface Mount; Case/Package: Nonstandard; Min Operating Temperature: -40°C; Max Operating Temperature: 125°C; Tolerance: 20%; Packaging: Tape and Reel; Termination: SMD/SMT; RMS Current (Irms): 6A; Series: WE-LHMI; Frequency: 13MHz; Package Quantity: 1; Current Rating: 6A; Series Resistance: 23.3MR; Length: 11mm; Width: 10mm; Height: 3.8mm; Height - Seated (Max): 0.157inch; Depth: 10mm; RoHS Compliant: Yes; Reach SVHC Compliant: Unknown; ComponentLink1URL: https://datasheet.ciiva.com/6693/74437368068-6693472.pdf?src-supplier=Digikey; ComponentLink1Description: https://datasheet.ciiva.com/6693/74437368068-6693472.pdf?src-supplier=Digikey; ComponentLink2URL: https://datasheet.ciiva.com/7691/1735874-7691598.pdf?src-supplier=Element14; ComponentLink2Description: https://datasheet.ciiva.com/7691/1735874-7691598.pdf?src-supplier=Element14; ComponentLink3URL: https://datasheet.ciiva.com/4961/74437368068-32931-4961343.pdf?src-supplier=Mouser; ComponentLink3Description: https://datasheet.ciiva.com/4961/74437368068-32931-4961343.pdf?src-supplier=Mouser; Supplier Part Number 1: 732-3390-1-ND
Q2 = TRANS_FET_CH__N_40V_30A_BUK9K18-40E,115: Transistor MOSFET Array Dual N -CH 40V 30A 8-Pin LFPAK-56D T/R; Manufacturer: Nexperia; Element Configuration: 5461ElementConfiguration; Fall Time: 9.9ns; Gate to Source Voltage (Vgs): 15V; Input Capacitance: 1.061nF; Max Power Dissipation: 38W; Number of Channels: 2NUMBER; Rds On Max: 16mR; Resistance: 19.5MR; Rise Time: 4.6ns; Turn-Off Delay Time: 17.5ns; Turn-On Delay Time: 4ns; Supplier 1: Mouser; Manufacturer Part Number: BUK9K18-40E,115; RoHS: Yes; Category: MOSFETs; Stock 1: 3358; Pricing 1: 1=1.03, 10=0.768, 50=0.768, 100=0.526, 500=0.458, 1000=0.369, 1500=0.352, 3000=0.306, 9000=0.293, 10000=0.293, 24000=0.292 (USD); Case/Package: 73Case; Number of Pins: 8NUMBER; Contact Plating: 154ConductorMaterial; Min Operating Temperature: -55°C; Max Operating Temperature: 175°C; Continuous Drain Current (ID): 30A; Drain to Source Voltage (Vdss): 40V; Max Dual Supply Voltage: 40V; Packaging: 10Packaging; RoHS Compliant: Yes; Lead Free: 5697LeadFree; ComponentLink1URL: https://datasheet.octopart.com/BUK9K18-40E%2C115-Nexperia-datasheet-87795944.pdf?src-supplier=Farnell; ComponentLink1Description: https://datasheet.octopart.com/BUK9K18-40E%2C115-Nexperia-datasheet-87795944.pdf?src-supplier=Farnell; Supplier Part Number 1: 771-BUK9K18-40E115
R63 = RES_10mR_1%_0.05W_0402: Res Current Sense Thick Film 0402 0.01 Ohm 1% 1/5W 0ppm/°C to 500ppm/°C Molded T/R; Manufacturer: Panasonic; Max Power Dissipation: 200mW; Supplier 1: Mouser; Manufacturer Part Number: ERJ-2LWFR010X; RoHS: Yes; Category: Chip SMD Resistors; Stock 1: 52793; Pricing 1: 1=0.24, 10=0.144, 50=0.13, 100=0.098, 500=0.08, 1000=0.071, 5000=0.061, 10000=0.056, 30000=0.056 (USD); Case Code (Metric): 1005; Case Code (Imperial): 0402; Min Operating Temperature: -55°C; Max Operating Temperature: 125°C; Packaging: Cut Tape; Temperature Coefficient: 500ppm/°C; Number of Terminations: 2; Features: Automotive AEC-Q200; Series: ERJ; Length: 0.039inch; Width: 0.02inch; Height: 0.018inch; RoHS Compliant: Yes; ComponentLink1URL: http://industrial.panasonic.com/cdbs/www-data/pdf/RDN0000/AOA0000C313.pdf?src-supplier=Farnell; ComponentLink1Description: http://industrial.panasonic.com/cdbs/www-data/pdf/RDN0000/AOA0000C313.pdf?src-supplier=Farnell; ComponentLink2URL: https://industrial.panasonic.com/cdbs/www-data/pdf/RDN0000/AOA0000C313.pdf?src-supplier=Digikey; ComponentLink2Description: https://industrial.panasonic.com/cdbs/www-data/pdf/RDN0000/AOA0000C313.pdf?src-supplier=Digikey; ComponentLink3URL: http://industrial.panasonic.com/cdbs/www-data/pdf/RDN0000/AOA0000C313.pdf?src-supplier=Element14; ComponentLink3Description: http://industrial.panasonic.com/cdbs/www-data/pdf/RDN0000/AOA0000C313.pdf?src-supplier=Element14; ComponentLink4URL: https://datasheet.octopart.com/ERJ2LWFR010X-Panasonic-datasheet-68299093.pdf?src-supplier=Future+Electronics; ComponentLink4Description: https://datasheet.octopart.com/ERJ2LWFR010X-Panasonic-datasheet-68299093.pdf?src-supplier=Future+Electronics; ComponentLink5URL: https://datasheet.octopart.com/ERJ2LWFR010X-Panasonic-datasheet-136473239.pdf?src-supplier=Newark; ComponentLink5Description: https://datasheet.octopart.com/ERJ2LWFR010X-Panasonic-datasheet-136473239.pdf?src-supplier=Newark; ComponentLink6URL: http://industrial.panasonic.com/cdbs/www-data/pdf/RDN0000/AOA0000C313.pdf?src-supplier=Newark; ComponentLink6Description: http://industrial.panasonic.com/cdbs/www-data/pdf/RDN0000/AOA0000C313.pdf?src-supplier=Newark; Supplier Part Number 1: 667-ERJ-2LWFR010X
R64 = RES_10mR_1%_1W_2512: Fixed Resistor, Metal Strip, 1W, 0.01ohm, 0.1V, 1% +/-Tol, 35ppm/Cel, Surface Mount, 2512; Manufacturer: Vishay; Resistance: 10mR; Voltage Rating: 100mV; Temperature Coefficient: 35ppm/°C; Supplier 1: Digikey; Manufacturer Part Number: WSK2512R0100FEA; RoHS: Yes; Category: Chip SMD Resistors; Stock 1: 6949; Pricing 1: 1=1.54, 10=1.011, 25=0.868, 50=0.7784, 100=0.7022, 250=0.61876, 500=0.56652, 1000=0.52212, 2000=0.48441, 4000=0.45237, 6000=0.43592, 10000=0.41731, 14000=0.40622, 20000=0.39539, 24000=0.3902 (USD); Case/Package: 2512; Case Code (Imperial): 2512; Case Code (Metric): 6432; Weight: 0.001429oz; Contact Plating: Tin; Min Operating Temperature: -65°C; Max Operating Temperature: 170°C; Power Rating: 1W; Tolerance: 1%; Packaging: Tape and Reel; Resistor Type: Metal Strip,Metal Film; Termination: SMD/SMT; Series: WSK; Resistance Tolerance: 1%; Technology: METAL STRIP; Voltage Rating (AC): 100mV; Length: 6.35mm; Width: 3.2mm; Height: 0.635mm; Depth: 3.18mm; Radiation Hardening: No; Reach SVHC Compliant: No; RoHS Compliant: Yes; ComponentLink1URL: https://datasheet.ciiva.com/11821/0900766b80d81ded-11821782.pdf?src-supplier=Rs; ComponentLink1Description: https://datasheet.ciiva.com/11821/0900766b80d81ded-11821782.pdf?src-supplier=Rs; ComponentLink2URL: https://datasheet.ciiva.com/9049/wsk-9049669.pdf?src-supplier=Avnet; ComponentLink2Description: https://datasheet.ciiva.com/9049/wsk-9049669.pdf?src-supplier=Avnet; Supplier Part Number 1: 541-WSK2512R0100FEACT-ND
R65 = RES_1M_1%_63mW_0402: Res Thick Film 0402 1M Ohm 1% 1/16W ±100ppm/°C Molded SMD SMD Paper Tape on Plastic Reel; Manufacturer: Bourns; Power Rating: 62.5mW; Voltage Rating: 50V; Max Power Dissipation: 63mW; Supplier 1: Digi-Key; Manufacturer Part Number: CR0402-FX-1004GLF; RoHS: Yes; Category: Chip SMD Resistors; Stock 1: 506989; Pricing 1: 1=0.1, 10=0.012, 50=0.0064, 100=0.0052, 500=0.00332, 1000=0.0028, 5000=0.00193 (USD); Mount: Surface Mount; Case Code (Metric): 1005; Case Code (Imperial): 0402; Contact Plating: Tin; Min Operating Temperature: -55°C; Max Operating Temperature: 125°C; Package Quantity: 10000; Packaging: Tape and Reel; Number of Terminations: 2; Termination: SMD/SMT; Temperature Coefficient: 100ppm/°C; Series: CR0402; Voltage Rating (DC): 50V; Length: 1mm; Width: 0.5mm; Height: 0.35mm; Thickness: 356um; Radiation Hardening: No; RoHS Compliant: Yes; ComponentLink1URL: http://www.mouser.com/ds/2/54/CR0402-72074.pdf?src-supplier=Mouser; ComponentLink1Description: http://www.mouser.com/ds/2/54/CR0402-72074.pdf?src-supplier=Mouser; ComponentLink2URL: http://www.farnell.com/datasheets/2194437.pdf?src-supplier=Farnell; ComponentLink2Description: http://www.farnell.com/datasheets/2194437.pdf?src-supplier=Farnell; ComponentLink3URL: http://components.arrow.com/part/dataview/41873878S8356545N1506?src-supplier=Arrow+Electronics; ComponentLink3Description: http://components.arrow.com/part/dataview/41873878S8356545N1506?src-supplier=Arrow+Electronics; ComponentLink4URL: https://datasheet.octopart.com/CR0402-FX-1004GLF-Bourns-datasheet-68301632.pdf?src-supplier=Farnell; ComponentLink4Description: https://datasheet.octopart.com/CR0402-FX-1004GLF-Bourns-datasheet-68301632.pdf?src-supplier=Farnell; ComponentLink5URL: http://www.bourns.com/pdfs/CR0402.pdf?src-supplier=Avnet; ComponentLink5Description: http://www.bourns.com/pdfs/CR0402.pdf?src-supplier=Avnet; ComponentLink6URL: https://www.bourns.com/docs/Product-Datasheets/CR0402.pdf?src-supplier=Digi-Key; ComponentLink6Description: https://www.bourns.com/docs/Product-Datasheets/CR0402.pdf?src-supplier=Digi-Key; ComponentLink7URL: http://www.farnell.com/datasheets/2194437.pdf?src-supplier=Element14; ComponentLink7Description: http://www.farnell.com/datasheets/2194437.pdf?src-supplier=Element14; ComponentLink8URL: http://www.farnell.com/datasheets/2194437.pdf?src-supplier=Newark; ComponentLink8Description: http://www.farnell.com/datasheets/2194437.pdf?src-supplier=Newark; ComponentLink9URL: https://datasheet.octopart.com/CR0402-FX-1004GLF-Bourns-datasheet-159578630.pdf?src-supplier=Electro+Sonic; ComponentLink9Description: https://datasheet.octopart.com/CR0402-FX-1004GLF-Bourns-datasheet-159578630.pdf?src-supplier=Electro+Sonic; ComponentLink10URL: https://datasheet.octopart.com/CR0402-FX-1004GLF-Bourns-datasheet-140567134.pdf?src-supplier=Arrow.cn; ComponentLink10Description: https://datasheet.octopart.com/CR0402-FX-1004GLF-Bourns-datasheet-140567134.pdf?src-supplier=Arrow.cn; Supplier Part Number 1: CR0402-FX-1004GLFCT-ND
R66 R67 = RES_5.1K_1%_100mW_0603: SMD Chip Resistor, 5.1 kOhm, ± 1%, 100 mW, 0603 [1608 Metric], Thick Film, General Purpose; Manufacturer: Yageo; Power Rating: 100mW; Temperature Coefficient: 100ppm/°C; Voltage Rating (DC): 50V; Supplier 1: Digi-Key; Manufacturer Part Number: RC0603FR-075K1L; RoHS: Yes; Category: Chip SMD Resistors; Stock 1: 3197702; Pricing 1: 1=0.1, 10=0.018, 50=0.0106, 100=0.0088, 500=0.00592, 1000=0.00505 (USD); Number of Pins: 2; Case Code (Imperial): 0603; Case Code (Metric): 1608; Size Code: 0603; Min Operating Temperature: -55°C; Max Operating Temperature: 155°C; Series: RC; Packaging: Tape and Reel; Package Quantity: 1; Termination: SMD/SMT; Resistor Type: Thick Film; Number of Terminations: 2; Max Power Dissipation: 100mW; Features: Moisture Resistant; Resistance Tolerance: 1%; Construction: Rectangular; Length: 0.063inch; Width: 0.031inch; Height: 0.022inch; Depth: 0.8mm; RoHS Compliant: Yes; Reach SVHC Compliant: No; Military Standard: Not; Lead Free: Lead Free; ComponentLink1URL: https://datasheet.ciiva.com/15189/getdatasheetpartid-326732-15189786.pdf?src-supplier=Verical; ComponentLink1Description: https://datasheet.ciiva.com/15189/getdatasheetpartid-326732-15189786.pdf?src-supplier=Verical; ComponentLink2URL: https://datasheet.ciiva.com/46395/443971-46395016.pdf?src-supplier=Element14; ComponentLink2Description: https://datasheet.ciiva.com/46395/443971-46395016.pdf?src-supplier=Element14; ComponentLink3URL: https://datasheet.ciiva.com/2454/pyu-r-int-thick-7-2454045.pdf?src-supplier=Digi-Key; ComponentLink3Description: https://datasheet.ciiva.com/2454/pyu-r-int-thick-7-2454045.pdf?src-supplier=Digi-Key; ComponentLink4URL: https://datasheet.ciiva.com/2454/pyu-r-int-thick-7-2454046.pdf?src-supplier=Digi-Key; ComponentLink4Description: https://datasheet.ciiva.com/2454/pyu-r-int-thick-7-2454046.pdf?src-supplier=Digi-Key; ComponentLink5URL: https://datasheet.ciiva.com/2454/pyu-r-int-thick-7-2454047.pdf?src-supplier=Digi-Key; ComponentLink5Description: https://datasheet.ciiva.com/2454/pyu-r-int-thick-7-2454047.pdf?src-supplier=Digi-Key; Supplier Part Number 1: 311-5.10KHRCT-ND; Voltage Rating: 50V
R68-R71 = RES_2.2K_1%_100mW_0603: SMD Chip Resistor, 2.2 Kohm, ½ 1%, 100 Mw, 0603 [1608 Metric], Thick Film, General Purpose; Manufacturer: Yageo; Temperature Coefficient: 100ppm/°C; Power Rating: 100mW; Voltage Rating: 50V; Supplier 1: Digikey; Manufacturer Part Number: RC0603FR-072K2L; RoHS: Yes; Category: Chip SMD Resistors; Stock 1: 455592; Pricing 1: 1=0.1, 10=0.011, 100=0.0082, 1000=0.00714, 2500=0.00461 (USD); Case Code (Imperial): 0603; Case Code (Metric): 1608; Size Code: 0603; Min Operating Temperature: -55°C; Max Operating Temperature: 155°C; Packaging: Tape and Reel; Resistor Type: Thick Film; Number of Terminations: 2; Max Power Dissipation: 100mW; Features: Moisture Resistant; Series: RC; Resistance Tolerance: 1%; Lead Free: Lead Free; Reach SVHC Compliant: Unknown; RoHS Compliant: Yes; ComponentLink1URL: https://datasheet.ciiva.com/46394/443971-46394958.pdf?src-supplier=Element14; ComponentLink1Description: https://datasheet.ciiva.com/46394/443971-46394958.pdf?src-supplier=Element14; ComponentLink2URL: https://datasheet.ciiva.com/46440/1868787-46440902.pdf?src-supplier=Element14; ComponentLink2Description: https://datasheet.ciiva.com/46440/1868787-46440902.pdf?src-supplier=Element14; ComponentLink3URL: https://datasheet.ciiva.com/7660/1868787-7660791.pdf?src-supplier=Element14; ComponentLink3Description: https://datasheet.ciiva.com/7660/1868787-7660791.pdf?src-supplier=Element14; ComponentLink4URL: https://datasheet.ciiva.com/7746/1738695-7746315.pdf?src-supplier=Element14; ComponentLink4Description: https://datasheet.ciiva.com/7746/1738695-7746315.pdf?src-supplier=Element14; ComponentLink5URL: https://datasheet.ciiva.com/7746/1738695-7746316.pdf?src-supplier=Element14; ComponentLink5Description: https://datasheet.ciiva.com/7746/1738695-7746316.pdf?src-supplier=Element14; Supplier Part Number 1: 311-2.20KHRDKR-ND